# Altium project Order_Alert_Display_Counter.PrjPcb
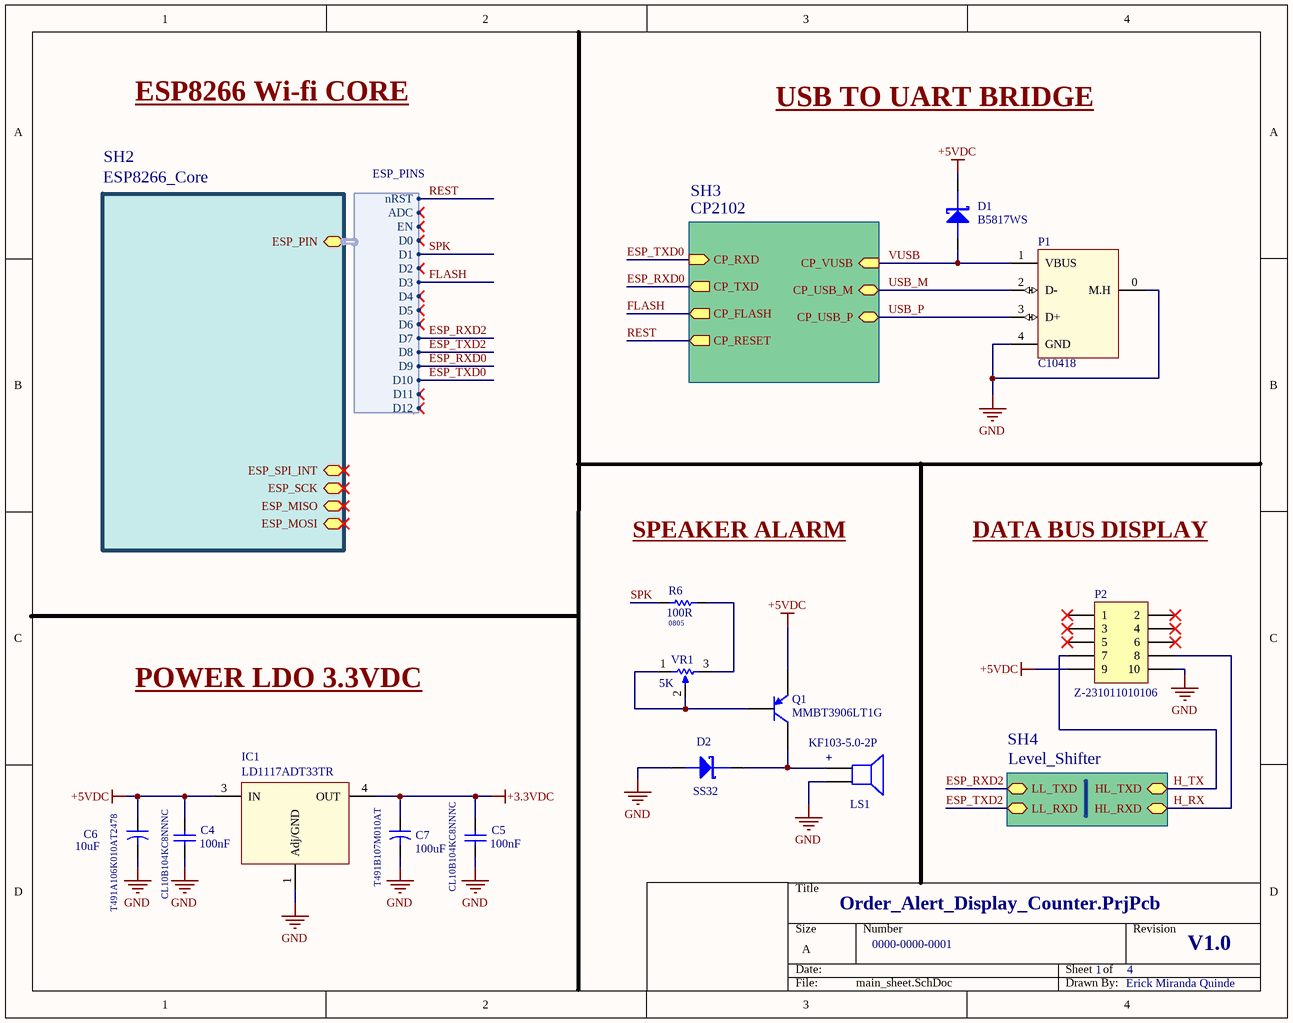
[diagram p0: main_sheet.SchDoc]
4 sheets, 38 parts. Net scope: hierarchical (ports join the sheet entries above them; power ports are global).
Board files: BOARD.PcbDoc, PLDISPLAYMASTER.PcbDoc, Edge_Board.PcbDoc, Edge_PLDISPLAYMASTER.PcbDoc
Sheets:
  main_sheet.SchDoc
    SH2 = ESP8266_Core.SchDoc
    SH3 = CP2102.SchDoc
    SH4 = Level_Shifter.SchDoc

## Sheet main_sheet.SchDoc
size A; Author: Erick Miranda Quinde; DrawnBy: Erick Miranda Quinde; Engineer: Erick Miranda Quinde; DocumentNumber: 0000-0000-0001; Revision: V1.0; SheetNumber: 1; SheetTotal: 4

### Parts
C4  CL10B104KC8NNNC  value 100nF  [C0603C104K5RACTU]
C5  CL10B104KC8NNNC  value 100nF  [C0603C104K5RACTU]
C6  T491A106K010AT2478  value 10uF  [3216 Case-A]
C7  T491B107M010AT  value 100uF  [TAJB107M006RNJ]
D1  B5817WS  [Diode S4]
D2  SS32  [DO-214AC)]
IC1  LD1117ADT33TR  [TO252]
LS1  KF103-5.0-2P  [VERDE 2pin]
P1  C10418  [USB_MICRO_B_AT]
P2  Z-231011010106  [IDC5X2]
Q1  MMBT3906LT1G  [SOT-23-TT3_N]
R6  value 100R  Package: 0805  [RES-0805]  (hidden comment: TC0525D1000T5E)
VR1  value 5K  [POT LIN VR1]  (hidden comment: 3362P-1-502LF)

### Sub-sheets
SH2 = ESP8266_Core: ESP_PIN (harness ESP_PINS), ESP_SCK, ESP_MISO, ESP_MOSI, ESP_SPI_INT
SH3 = CP2102: CP_USB_M (bidir), CP_USB_P (bidir), CP_VUSB (in), CP_RXD (in), CP_TXD (out), CP_FLASH (out), CP_RESET (out)
SH4 = Level_Shifter: HL_TXD, HL_RXD, LL_TXD, LL_RXD

### Harnesses
ESP_PINS: D12, D11, D10, D9, D3, D8, D7, D6, D5, D4, D2, D1, D0, EN, ADC, nRST

### Nets
+3.3VDC: C5.2 C7.1 IC1.4(OUT)
+5VDC: C4.2 C6.1 D1.1(K) IC1.3(IN) P2.9 Q1.2(E)
GND: C4.1 C5.1 C6.2 C7.2 D2.2(A) IC1.1(Adj/GND) LS1.2 P1.0(M.H) P1.4(GND) P2.10
ESP_RXD0: sheet SH3/CP_TXD, sheet SH2/ESP_PIN.D9
ESP_RXD2: sheet SH4/LL_TXD, sheet SH2/ESP_PIN.D7
ESP_TXD0: sheet SH3/CP_RXD, sheet SH2/ESP_PIN.D10
ESP_TXD2: sheet SH4/LL_RXD, sheet SH2/ESP_PIN.D8
FLASH: sheet SH3/CP_FLASH, sheet SH2/ESP_PIN.D3
H_RX: P2.8 ; sheet SH4/HL_RXD
H_TX: P2.7 ; sheet SH4/HL_TXD
REST: sheet SH3/CP_RESET, sheet SH2/ESP_PIN.nRST  [project net nRST]
SPK: R6.1 ; sheet SH2/ESP_PIN.D1  [project net GPIO5]
USB_M: P1.2(D-) ; sheet SH3/CP_USB_M
USB_P: P1.3(D+) ; sheet SH3/CP_USB_P
VUSB: D1.2(A) P1.1(VBUS) ; sheet SH3/CP_VUSB
NetD2_1: D2.1(K) LS1.1 Q1.3(C)
NetQ1_1: Q1.1(B) VR1.1 VR1.2
NetR6_2: R6.2 VR1.3

Not connected (* = marked no-connect by the designer): P2 1* 2* 3* 4* 5* 6*

### Notes on the sheet
- ESP8266 Wi-fi CORE
- USB TO UART BRIDGE
- SPEAKER ALARM
- DATA BUS DISPLAY
- POWER LDO 3.3VDC
- (near LS1) +

### Library data of the parts
C4 C5 = Cap 100nF (0603): PART_NUM: CL10B104KC8NNNC; Price: $0.02; Link Store: https://lcsc.com/product-detail/Multilayer-Ceramic-Capacitors-MLCC-SMD-SMT_SAMSUNG_CL10B104KC8NNNC_100nF-104-10-100V_C15725.html; LCSC Part: C15725
C6 = T491A106M006AT: CAP TANT 10UF 6.3V 20% 1206; Price: $0.11; Link Store: https://lcsc.com/product-detail/Tantalum-Capacitors_KEMET_T491A106K010AT_10uF-106-10-10V_C110052.html; LCSC Part: C110052
C7 = Cap 10uF (C3216): Capacitor; Price: $0.29; Link Store: https://lcsc.com/product-detail/Tantalum-Capacitors_KEMET-T491B107M010AT_C90975.html; LCSC Part: C90975
D1 = 1N5817: Price: $0.0211; Link Store: https://lcsc.com/product-detail/Schottky-Barrier-Diodes-SBD_Shikues-B5817WS_C122854.html; LCSC Part: C122854
D2 = CD214A-B340LF: DIODE SCHOTTKY 40V 3A SMA; Price: $0.03; Link Store: https://lcsc.com/product-detail/Schottky-Barrier-Diodes-SBD_MDD-Microdiode-Electronics-SS32_C34897.html; LCSC Part: C34897
IC1 = LM1117DT: 800mA Low-Dropout Linear Regulator; Manufacturer: National Semiconductor; Datasheet: http://www.national.com/ds/LM/LM1117.pdf; Price: $0.96; Link Store: https://lcsc.com/product-detail/Low-Dropout-Regulators-LDO_STMicroelectronics-LD1117ADT33TR_C157401.html; LCSC Part: C157401
LS1 = Speaker: Published: 24-Mar-1999; LatestRevisionDate: 17-Jul-2002; LatestRevisionNote: Re-released for DXP Platform.; PackageReference: PIN2; Publisher: Altium Limited; Price: $0.12; Link Store: https://lcsc.com/product-detail/New-Quadratic-Unclassified-Data_Cixi-Kefa-Elec-KF103-5-0-2P_C475088.html; LCSC Part: C475088
P1 = USB Mini: USB Micro; Price: $0.06; Link Store: https://lcsc.com/product-detail/USB-Connectors_Jing-Extension-of-the-Electronic-Co-Jing-Extension-of-the-Electronic-Co-MICRO-USB-5S-B-Type-horns-High-temperature_C10418.html; LCSC Part: C10418
P2 = IDC  5X2: Header, 5-Pin, Dual row; LatestRevisionDate: 17-Jul-2002; LatestRevisionNote: Re-released for DXP Platform.; Publisher: Altium Limited; Price: $0.16; Link Store: https://lcsc.com/product-detail/IDC-Connectors_nextron-Nextronics-Engineering-Z-231011010106_C221045.html; LCSC Part: C221045
Q1 = 2N3906: Manufacturer: Micro Commercial Co; Manufacturer Part Number: 2N3906-AP; Transistor Type: PNP; Current - Collector (Ic) (Max): 200mA; Voltage - Collector Emitter Breakdown (Max): 40V; Vce Saturation (Max) @ Ib, Ic: 400mV @ 5mA, 50mA; DC Current Gain (hFE) (Min) @ Ic, Vce: 100 @ 10mA, 1V; Power - Max: 600mW; Frequency - Transition: 250MHz; Supplier 1: Digi-Key; RoHS: RoHS Compliant; Category: Discrete Semiconductor Products; Stock 1: 54000; Pricing 1: 2000=0.0306, 6000=0.0276, 10000=0.024, 50000=0.0192, 100000=0.018, 200000=0.01596 (USD); Packaging: Tape & Box (TB); Current - Collector Cutoff (Max): -; Mounting Type: Through Hole; Package / Case: TO-226-3, TO-92-3 (TO-226AA) Formed Leads; Supplier Device Package: TO-92; ComponentLink1URL: http://www.mccsemi.com/up_pdf/2N3906(TO-92).pdf; ComponentLink1Description: http://www.mccsemi.com/up_pdf/2N3906(TO-92).pdf; Supplier Part Number 1: 2N3906-APTB-ND; Price: $0.0072; Link Store: https://lcsc.com/product-detail/Transistors-NPN-PNP_ON-Semiconductor-MMBT3906LT1G_C53444.html; LCSC Part: C53444
R6 = Resistor: Published: 8-Jun-2000; LatestRevisionDate: 17-Jul-2002; LatestRevisionNote: Re-released for DXP Platform.; PackageReference: AXIAL-0.3; Publisher: Altium Limited; PackageDescription: Axial Device, Thru-Hole; 2 Leads; 0.3 in Pin Spacing; Price: $0.024; Link Store: https://lcsc.com/product-detail/High-Precision-Low-TCR-SMD-Resistors_UNI-ROYAL-Uniroyal-Elec-TC0525D1000T5E_C44786.html; LCSC Part: C44786
VR1 = Trimmer Cermet 104: Price: $0.22; PARTNUM: 3362P-1-502LF; Link Store: https://lcsc.com/product-detail/Precision-Potentiometer_BOURNS_3362P-1-502LF_5KR_C81260.html; LCSC Part: C81260

## Sheet ESP8266_Core.SchDoc
size A; Author: Erick Miranda Quinde; DrawnBy: Erick Miranda Quinde; DocumentNumber: 0000-0000-0002; Revision: V1.0; SheetNumber: 2; SheetTotal: 4
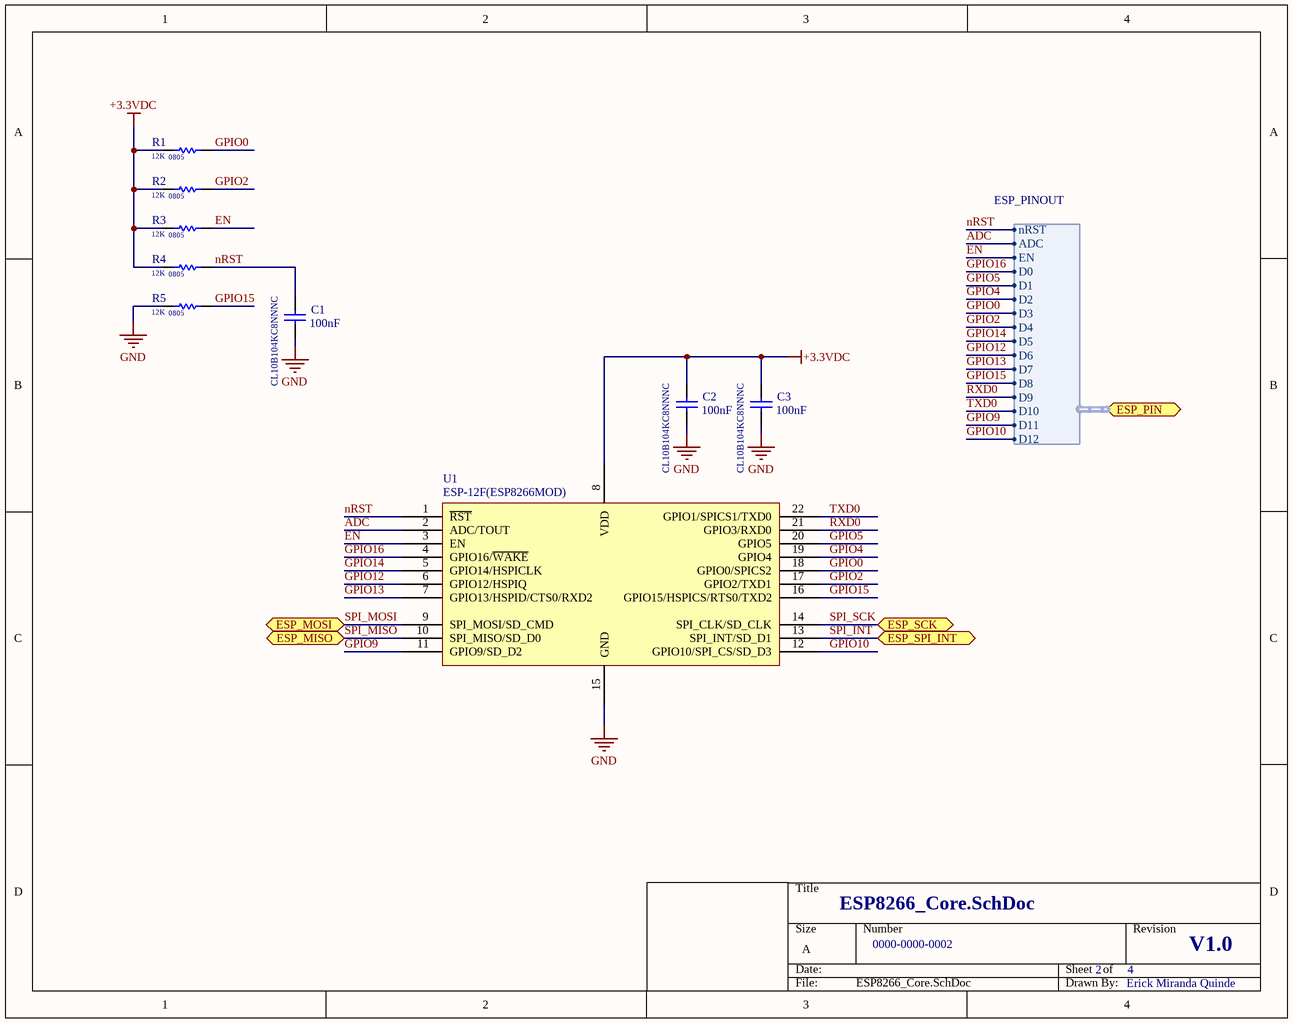
[diagram p1: ESP8266_Core.SchDoc]

### Parts
C1  CL10B104KC8NNNC  value 100nF  [C0603C104K5RACTU]
C2  CL10B104KC8NNNC  value 100nF  [C0603C104K5RACTU]
C3  CL10B104KC8NNNC  value 100nF  [C0603C104K5RACTU]
R1  value 12K  Package: 0805  [RES-0805]  (hidden comment: ERJ6RBD1202V)
R2  value 12K  Package: 0805  [RES-0805]  (hidden comment: ERJ6RBD1202V)
R3  value 12K  Package: 0805  [RES-0805]  (hidden comment: ERJ6RBD1202V)
R4  value 12K  Package: 0805  [RES-0805]  (hidden comment: ERJ6RBD1202V)
R5  value 12K  Package: 0805  [RES-0805]  (hidden comment: ERJ6RBD1202V)
U1  ESP-12F(ESP8266MOD)  [ESP-12E&F Module]

### Ports
ESP_MISO, ESP_MOSI, ESP_PIN (harness ESP_PINOUT), ESP_SCK, ESP_SPI_INT

### Harnesses
ESP_PINOUT: nRST, ADC, EN, D0, D1, D2, D3, D4, D5, D6, D7, D8, D9, D10, D11, D12

### Nets
+3.3VDC: C2.2 C3.2 R1.1 R2.1 R3.1 R4.1 U1.8(VDD)
GND: C1.1 C2.1 C3.1 R5.1 U1.15(GND)
ADC: U1.2(ADC/TOUT) ; port ESP_PIN.ADC
EN: R3.2 U1.3(EN) ; port ESP_PIN.EN
GPIO0: R1.2 U1.18(GPIO0/SPICS2) ; port ESP_PIN.D3  [project net FLASH]
GPIO2: R2.2 U1.17(GPIO2/TXD1) ; port ESP_PIN.D4
GPIO4: U1.19(GPIO4) ; port ESP_PIN.D2
GPIO5: U1.20(GPIO5) ; port ESP_PIN.D1
GPIO9: U1.11(GPIO9/SD_D2) ; port ESP_PIN.D11
GPIO10: U1.12(GPIO10/SPI_CS/SD_D3) ; port ESP_PIN.D12
GPIO12: U1.6(GPIO12/HSPIQ) ; port ESP_PIN.D6
GPIO13: U1.7(GPIO13/HSPID/CTS0/RXD2) ; port ESP_PIN.D7  [project net ESP_RXD2]
GPIO14: U1.5(GPIO14/HSPICLK) ; port ESP_PIN.D5
GPIO15: R5.2 U1.16(GPIO15/HSPICS/RTS0/TXD2) ; port ESP_PIN.D8  [project net ESP_TXD2]
GPIO16: U1.4(GPIO16/~{WAKE}) ; port ESP_PIN.D0
nRST: C1.2 R4.2 U1.1(~{RST}) ; port ESP_PIN.nRST
RXD0: U1.21(GPIO3/RXD0) ; port ESP_PIN.D9  [project net ESP_RXD0]
SPI_INT: U1.13(SPI_INT/SD_D1) ; port ESP_SPI_INT
SPI_MISO: U1.10(SPI_MISO/SD_D0) ; port ESP_MISO
SPI_MOSI: U1.9(SPI_MOSI/SD_CMD) ; port ESP_MOSI
SPI_SCK: U1.14(SPI_CLK/SD_CLK) ; port ESP_SCK
TXD0: U1.22(GPIO1/SPICS1/TXD0) ; port ESP_PIN.D10  [project net ESP_TXD0]

### Library data of the parts
C1-C3 = Cap 100nF (0603): PART_NUM: CL10B104KC8NNNC; Price: $0.02; Link Store: https://lcsc.com/product-detail/Multilayer-Ceramic-Capacitors-MLCC-SMD-SMT_SAMSUNG_CL10B104KC8NNNC_100nF-104-10-100V_C15725.html
  C1: LCSC PArt: C15725
  C2 C3: LCSC Part: C15725
R1-R5 = Resistor: Published: 8-Jun-2000; LatestRevisionDate: 17-Jul-2002; LatestRevisionNote: Re-released for DXP Platform.; PackageReference: AXIAL-0.3; Publisher: Altium Limited; PackageDescription: Axial Device, Thru-Hole; 2 Leads; 0.3 in Pin Spacing; Price: $0.021; Link Store: https://lcsc.com/product-detail/Others_PANASONIC-ERJ6RBD1202V_C336850.html; LCSC Part: C336850
U1 = ESP-12E&F Module: Price: $1.9; Link Store: https://lcsc.com/product-detail/WIFI-Modules_ESP-12F-ESP8266MOD_C82891.html; LCSC Part: C82891

## Sheet CP2102.SchDoc
size A; Author: Erick Miranda Quinde; DrawnBy: Erick Miranda Quinde; DocumentNumber: 0000-0000-0003; Revision: V1.0; SheetNumber: 3; SheetTotal: 4
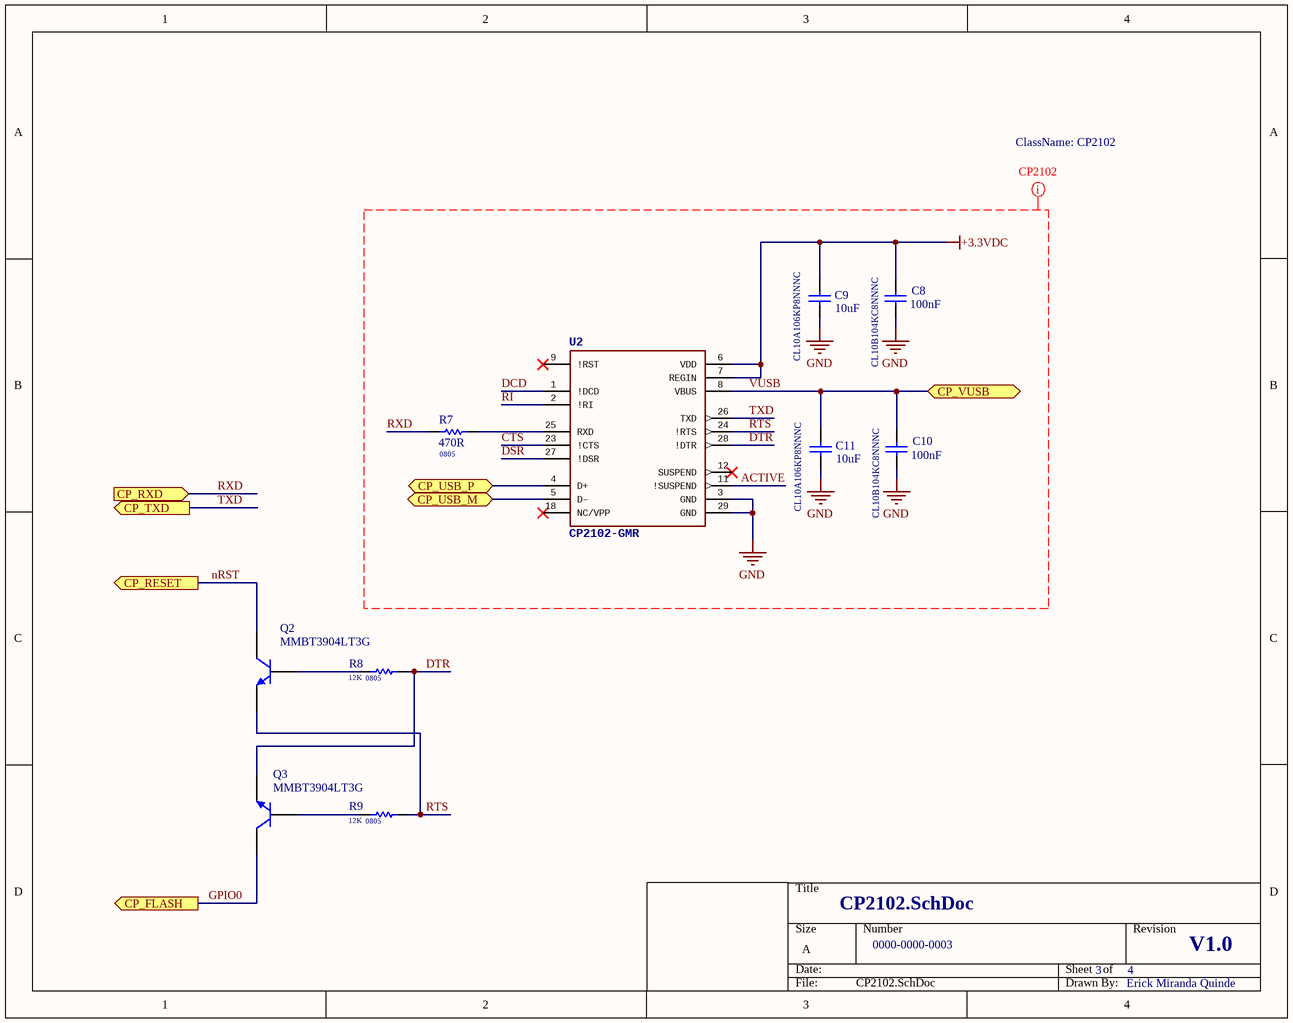
[diagram p2: CP2102.SchDoc]

### Parts
C8  CL10B104KC8NNNC  value 100nF  [C0603C104K5RACTU]
C9  CL10A106KP8NNNC  value 10uF  [C0603C104K5RACTU]
C10  CL10B104KC8NNNC  value 100nF  [C0603C104K5RACTU]
C11  CL10A106KP8NNNC  value 10uF  [C0603C104K5RACTU]
Q2  MMBT3904LT3G  [SOT-23-TT3_N]
Q3  MMBT3904LT3G  [SOT-23-TT3_N]
R7  value 470R  Package: 0805  [RES-0805]  (hidden comment: 0805W8F4700T5E)
R8  value 12K  Package: 0805  [RES-0805]  (hidden comment: 0805W8F1202T5E)
R9  value 12K  Package: 0805  [RES-0805]  (hidden comment: 0805W8F1202T5E)
U2  CP2102-GMR  [QFN50P500X500X100-29N]

### Ports
CP_FLASH (out), CP_RESET (out), CP_RXD (in), CP_TXD (out), CP_USB_M (bidir), CP_USB_P (bidir), CP_VUSB

### Nets
+3.3VDC: C8.2 C9.2 U2.6(VDD) U2.7(REGIN)
GND: C8.1 C9.1 C10.1 C11.1 U2.3(GND) U2.29(GND)
ACTIVE: U2.11(!SUSPEND)
CTS: U2.23(!CTS)
DCD: U2.1(!DCD)
DSR: U2.27(!DSR)
DTR: Q3.2(E) R8.2 U2.28(!DTR)
GPIO0: Q3.3(C) ; port CP_FLASH  [project net FLASH]
nRST: Q2.3(C) ; port CP_RESET
RI: U2.2(!RI)
RTS: Q2.2(E) R9.2 U2.24(!RTS)
RXD: R7.1 ; port CP_RXD  [project net ESP_TXD0]
TXD: U2.26(TXD) ; port CP_TXD  [project net ESP_RXD0]
USB_M: U2.5(D–) ; port CP_USB_M
USB_P: U2.4(D+) ; port CP_USB_P
VUSB: C10.2 C11.2 U2.8(VBUS) ; port CP_VUSB
NetQ2_1: Q2.1(B) R8.1
NetQ3_1: Q3.1(B) R9.1
NetR7_2: R7.2 U2.25(RXD)

Not connected (* = marked no-connect by the designer): U2 9(!RST)* 12(SUSPEND)* 18(NC/VPP)*

### Layout directives
net class CP2102: +3.3VDC, ACTIVE, CTS, DCD, DSR, DTR, GND, RI, RTS, RXD, TXD, VUSB

### Library data of the parts
C8-C11 = Cap 100nF (0603)
  C8 C10: PART_NUM: CL10B104KC8NNNC; Price: $0.02; Link Store: https://lcsc.com/product-detail/Multilayer-Ceramic-Capacitors-MLCC-SMD-SMT_SAMSUNG_CL10B104KC8NNNC_100nF-104-10-100V_C15725.html; LCSC Part: C15725
  C9 C11: PART_NUM: CL10A106KP8NNNC; Price: $0.04; Link Store: https://lcsc.com/product-detail/Multilayer-Ceramic-Capacitors-MLCC-SMD-SMT_Samsung-Electro-Mechanics-CL10A106KP8NNNC_C19702.html; LCSC Part: C19702
Q2 Q3 = 2N3904: Price: $0.019; Link Store: https://lcsc.com/product-detail/Transistors-NPN-PNP_ON-Semiconductor-ON-MMBT3904LT3G_C150052.html; LCSC Part: C150052
R7-R9 = Resistor: Published: 8-Jun-2000; LatestRevisionDate: 17-Jul-2002; LatestRevisionNote: Re-released for DXP Platform.; PackageReference: AXIAL-0.3; Publisher: Altium Limited; PackageDescription: Axial Device, Thru-Hole; 2 Leads; 0.3 in Pin Spacing
  R7: Price: $0.0025; Link Store: https://lcsc.com/product-detail/Chip-Resistor-Surface-Mount_UNI-ROYAL-Uniroyal-Elec-0805W8F4700T5E_C17710.html; LCSC Part: C17710
  R8 R9: Price: $0.029; Link Store: https://lcsc.com/product-detail/Chip-Resistor-Surface-Mount_UNI-ROYAL-Uniroyal-Elec-0805W8F1202T5E_C17444.html; LCSC Part: C17444
U2 = CP2102-GM: MF: Silicon Labs; Package: VFQFN-28 Vishay Siliconix; Price: $1.6; Availability: Unavailable; MP: CP2102-GMR; Link Store: https://lcsc.com/product-detail/USB-ICs_SILICON-LABS_CP2102-GMR_SILICON-LABS-CP2102-GMR_C6568.html; LCSC Part: C6568

## Sheet Level_Shifter.SchDoc
size A; Author: Erick Miranda Quinde; DrawnBy: Erick Miranda Quinde; DocumentNumber: 0000-0000-0004; Revision: V1.0; SheetNumber: 4; SheetTotal: 4
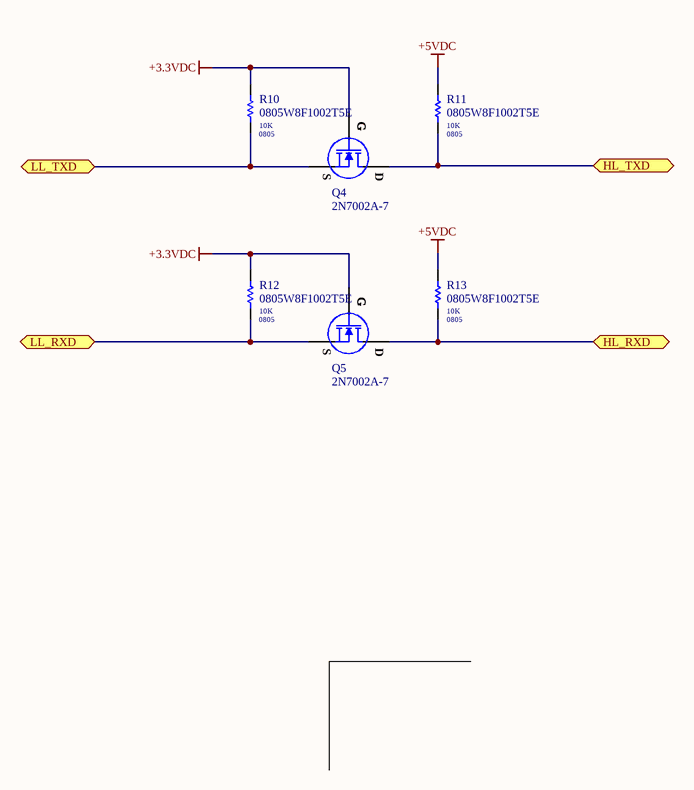
[diagram p3: Level_Shifter.SchDoc]

### Parts
Q4  2N7002A-7  [SuperSOT-3]
Q5  2N7002A-7  [SuperSOT-3]
R10  0805W8F1002T5E  value 10K  Package: 0805  [RES-0805]
R11  0805W8F1002T5E  value 10K  Package: 0805  [RES-0805]
R12  0805W8F1002T5E  value 10K  Package: 0805  [RES-0805]
R13  0805W8F1002T5E  value 10K  Package: 0805  [RES-0805]

### Ports
HL_RXD, HL_TXD, LL_RXD, LL_TXD

### Nets
+3.3VDC: Q4.2(G) Q5.2(G) R10.2 R12.2
+5VDC: R11.2 R13.2
ESP_RXD2: Q4.1(S) R10.1 ; port LL_TXD
ESP_TXD2: Q5.1(S) R12.1 ; port LL_RXD
H_RX: Q5.3(D) R13.1 ; port HL_RXD
H_TX: Q4.3(D) R11.1 ; port HL_TXD

### Library data of the parts
Q4 Q5 = MOSFET N channel: N-Channel MOSFET; Published: 8-Jun-2000; LatestRevisionDate: 17-Jul-2002; LatestRevisionNote: Re-released for DXP Platform.; PackageVersion: 1995/1996; PackageReference: E3; Publisher: Altium Limited; Price: $0.026; Link Store: https://lcsc.com/product-detail/MOSFET_Diodes-Incorporated_2N7002A-7_Diodes-Incorporated-2N7002A-7_C139446.html; LCSC Part: C139446
R10-R13 = Resistor: Published: 8-Jun-2000; LatestRevisionDate: 17-Jul-2002; LatestRevisionNote: Re-released for DXP Platform.; PackageReference: AXIAL-0.3; Publisher: Altium Limited; PackageDescription: Axial Device, Thru-Hole; 2 Leads; 0.3 in Pin Spacing; Price: $0.0023; Link Store: https://lcsc.com/product-detail/Chip-Resistor-Surface-Mount_UNI-ROYAL-Uniroyal-Elec-0805W8F1002T5E_C17414.html; LCSC Part: C17414

## Nets that join several sheets
+3.3VDC: main_sheet (C5.2 C7.1 IC1.4), ESP8266_Core (7 pins), CP2102 (C8.2 C9.2 U2.6 U2.7), Level_Shifter (Q4.2 Q5.2 R10.2 R12.2)
+5VDC: main_sheet (6 pins), Level_Shifter (R11.2 R13.2)
GND: main_sheet (10 pins), ESP8266_Core (5 pins), CP2102 (6 pins)
ESP_RXD0: ESP8266_Core (U1.21), CP2102 (U2.26)
ESP_RXD2: ESP8266_Core (U1.7), Level_Shifter (Q4.1 R10.1)
ESP_TXD0: ESP8266_Core (U1.22), CP2102 (R7.1)
ESP_TXD2: ESP8266_Core (R5.2 U1.16), Level_Shifter (Q5.1 R12.1)
FLASH: ESP8266_Core (R1.2 U1.18), CP2102 (Q3.3)
GPIO5: main_sheet (R6.1), ESP8266_Core (U1.20)
H_RX: main_sheet (P2.8), Level_Shifter (Q5.3 R13.1)
H_TX: main_sheet (P2.7), Level_Shifter (Q4.3 R11.1)
nRST: ESP8266_Core (C1.2 R4.2 U1.1), CP2102 (Q2.3)
USB_M: main_sheet (P1.2), CP2102 (U2.5)
USB_P: main_sheet (P1.3), CP2102 (U2.4)
VUSB: main_sheet (D1.2 P1.1), CP2102 (C10.2 C11.2 U2.8)